# EAGLE board Instruction_memory (EAGLE 9.4.2), part 1 of 2
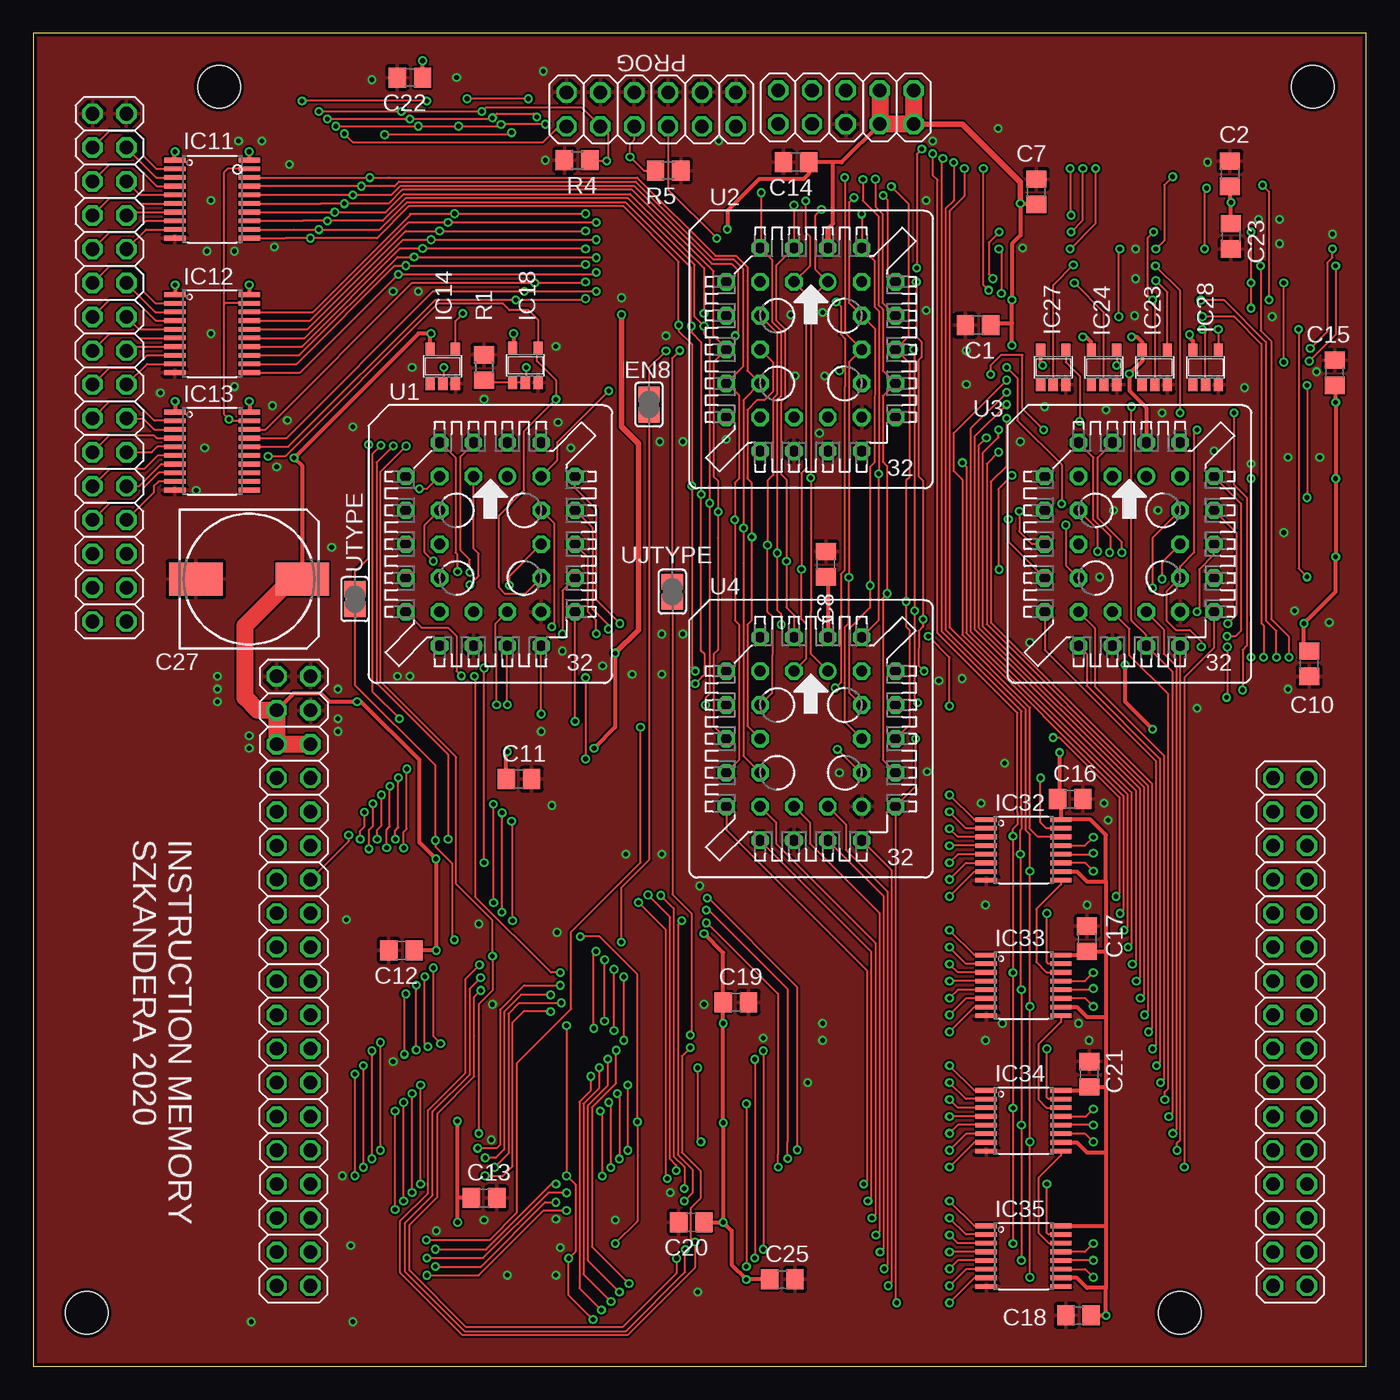
[diagram p2: board, top side]
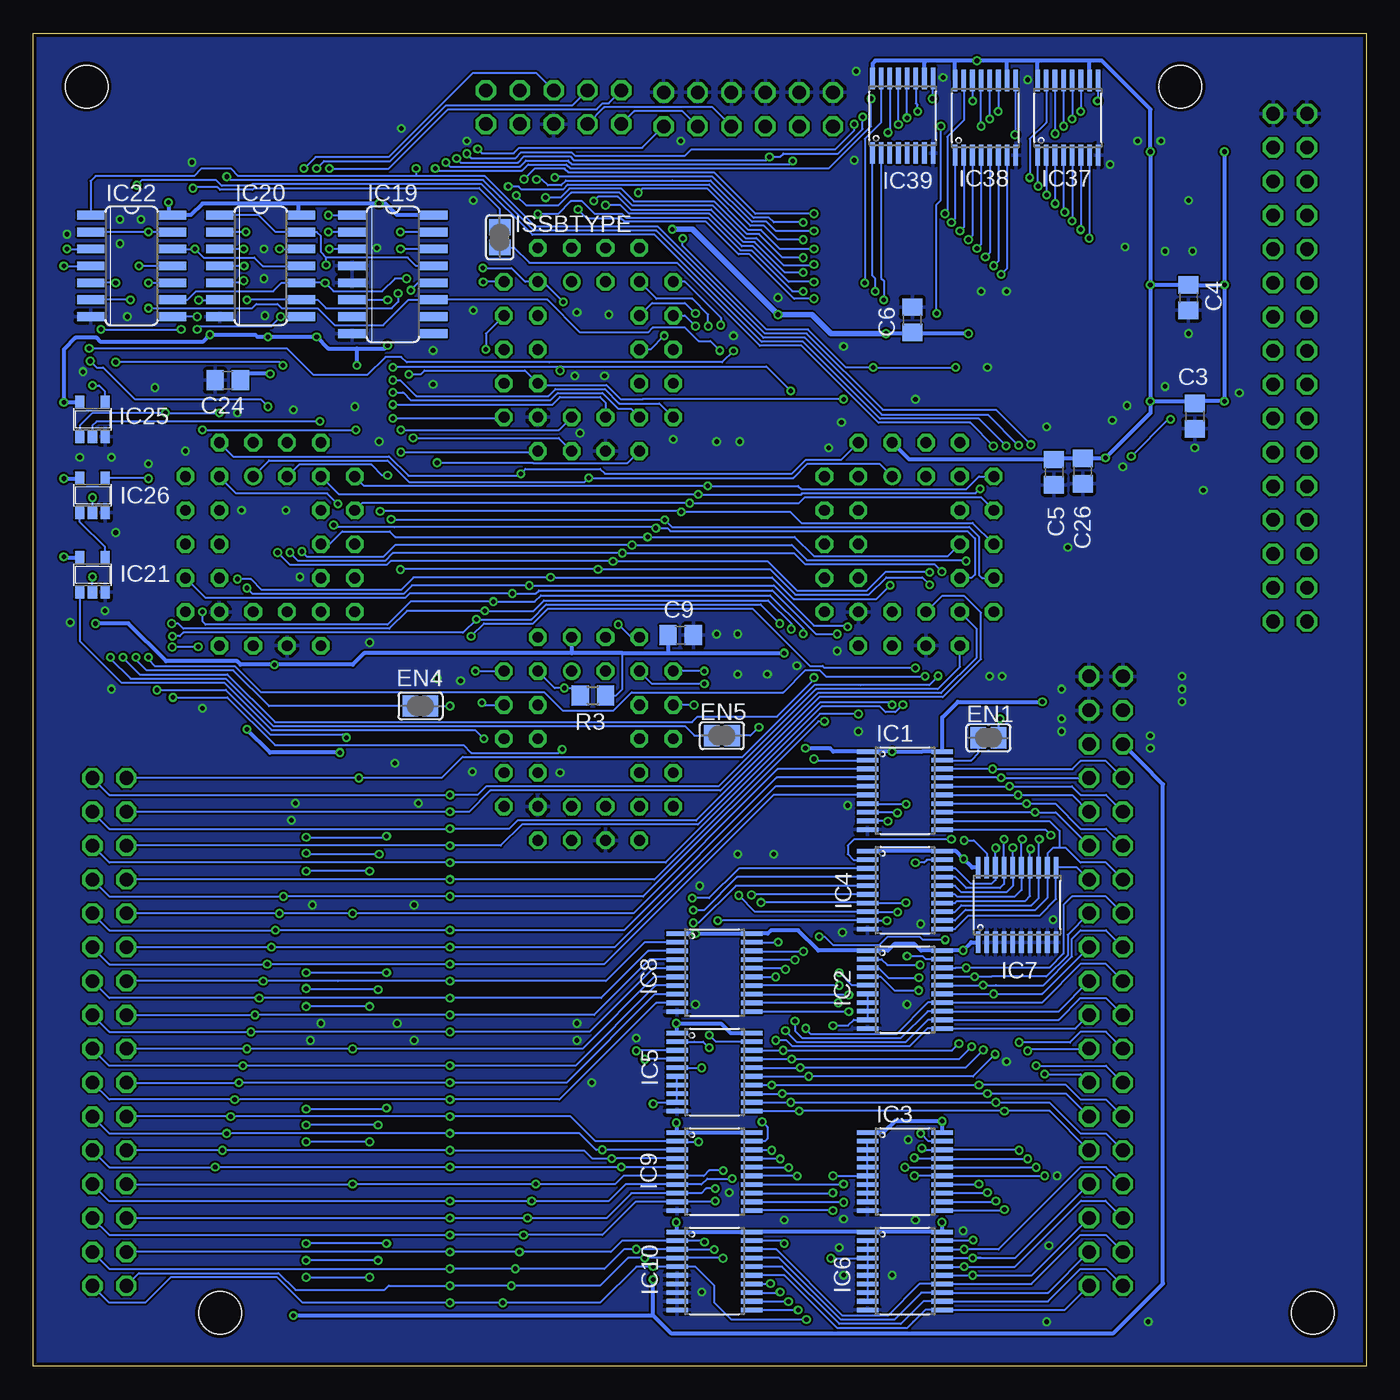
[diagram p3: board, bottom side, seen from below]

Size 100 x 100 mm. Coordinates in mm from the lower left corner, seen from the top.
Outline: 0,0 100,0 100,100 0,100 0,0
Copper layers (1*16): Top 0.035mm / dielectric 1.5mm / Bottom 0.035mm
Design rules "SeeedStudio_2layer_DRU_no_angle_20140221": minimum track width 6mil, minimum drill 12mil, track to track 6mil, track to pad 6mil, pad to pad 6mil, via to via 6mil, smd to smd 0mil, copper to edge 10mil, drill to drill 10mil, minimum pad ring 10mil, minimum via ring 6mil, stop-mask expansion 2mil, vias tented up to drill 100mil, thermal gap 10mil
Holes 3.2 mm at 13.93,96 96,96 4,4 86,4

## Footprints (pad centres in the part's own frame; a part is rotated, then mirrored left to right if it is on the bottom)
C0805 = smd 1.3 x 1.5: 1 -0.95,0; 2 0.95,0
153CLV-1010 = smd 4 x 2.5: + 4,0; - -4,0
SJ = smd 1.168 x 1.6: 1 -0.762,0; 2 0.762,0
TSSOP20 = smd 0.35 x 1.6: 1 -2.925,-2.8; 2 -2.275,-2.8; 3 -1.625,-2.8; 4 -0.975,-2.8; 5 -0.325,-2.8; 6 0.325,-2.8; 7 0.975,-2.8; 8 1.625,-2.8; 9 2.275,-2.8; 10 2.925,-2.8; 11 2.925,2.8; 12 2.275,2.8; 13 1.625,2.8; 14 0.975,2.8; 15 0.325,2.8; 16 -0.325,2.8; 17 -0.975,2.8; 18 -1.625,2.8; 19 -2.275,2.8; 20 -2.925,2.8
SOT23-5 = smd 0.69 x 0.99: 1 -0.95,-1.29; 2 0,-1.29; 3 0.95,-1.29; 4 0.95,1.3; 5 -0.95,1.3
SO16 = smd 0.66 x 2.032: 1 -4.445,-3.073; 2 -3.175,-3.073; 3 -1.905,-3.073; 4 -0.635,-3.073; 5 0.635,-3.073; 6 1.905,-3.073; 7 3.175,-3.073; 8 4.445,-3.073; 9 4.445,3.073; 10 3.175,3.073; 11 1.905,3.073; 12 0.635,3.073; 13 -0.635,3.073; 14 -1.905,3.073; 15 -3.175,3.073; 16 -4.445,3.073
SO14 = smd 0.66 x 2.032: 1 -3.81,-3.073; 2 -2.54,-3.073; 3 -1.27,-3.073; 4 0,-3.073; 5 1.27,-3.073; 6 2.54,-3.073; 7 3.81,-3.073; 8 3.81,3.073; 9 2.54,3.073; 10 1.27,3.073; 11 0,3.073; 12 -1.27,3.073; 13 -2.54,3.073; 14 -3.81,3.073
TSSOP16 = smd 0.35 x 1.6: 1 -2.275,-2.8; 2 -1.625,-2.8; 3 -0.975,-2.8; 4 -0.325,-2.8; 5 0.325,-2.8; 6 0.975,-2.8; 7 1.625,-2.8; 8 2.275,-2.8; 9 2.275,2.8; 10 1.625,2.8; 11 0.975,2.8; 12 0.325,2.8; 13 -0.325,2.8; 14 -0.975,2.8; 15 -1.625,2.8; 16 -2.275,2.8
2X19 = drill 1.016 octagon: 1 -22.86,-1.27; 2 -22.86,1.27; 3 -20.32,-1.27; 4 -20.32,1.27; 5 -17.78,-1.27; 6 -17.78,1.27; 7 -15.24,-1.27; 8 -15.24,1.27; 9 -12.7,-1.27; 10 -12.7,1.27; 11 -10.16,-1.27; 12 -10.16,1.27; 13 -7.62,-1.27; 14 -7.62,1.27; 15 -5.08,-1.27; 16 -5.08,1.27; 17 -2.54,-1.27; 18 -2.54,1.27; 19 0,-1.27; 20 0,1.27; 21 2.54,-1.27; 22 2.54,1.27; 23 5.08,-1.27; 24 5.08,1.27; 25 7.62,-1.27; 26 7.62,1.27; 27 10.16,-1.27; 28 10.16,1.27; 29 12.7,-1.27; 30 12.7,1.27; 31 15.24,-1.27; 32 15.24,1.27; 33 17.78,-1.27; 34 17.78,1.27; 35 20.32,-1.27; 36 20.32,1.27; 37 22.86,-1.27; 38 22.86,1.27
2X16 = drill 1.016 octagon: 1 -19.05,-1.27; 2 -19.05,1.27; 3 -16.51,-1.27; 4 -16.51,1.27; 5 -13.97,-1.27; 6 -13.97,1.27; 7 -11.43,-1.27; 8 -11.43,1.27; 9 -8.89,-1.27; 10 -8.89,1.27; 11 -6.35,-1.27; 12 -6.35,1.27; 13 -3.81,-1.27; 14 -3.81,1.27; 15 -1.27,-1.27; 16 -1.27,1.27; 17 1.27,-1.27; 18 1.27,1.27; 19 3.81,-1.27; 20 3.81,1.27; 21 6.35,-1.27; 22 6.35,1.27; 23 8.89,-1.27; 24 8.89,1.27; 25 11.43,-1.27; 26 11.43,1.27; 27 13.97,-1.27; 28 13.97,1.27; 29 16.51,-1.27; 30 16.51,1.27; 31 19.05,-1.27; 32 19.05,1.27
2X06 = drill 1.016 octagon: 1 -6.35,-1.27; 2 -6.35,1.27; 3 -3.81,-1.27; 4 -3.81,1.27; 5 -1.27,-1.27; 6 -1.27,1.27; 7 1.27,-1.27; 8 1.27,1.27; 9 3.81,-1.27; 10 3.81,1.27; 11 6.35,-1.27; 12 6.35,1.27
2X05 = drill 1.016 octagon: 1 -5.08,-1.27; 2 -5.08,1.27; 3 -2.54,-1.27; 4 -2.54,1.27; 5 0,-1.27; 6 0,1.27; 7 2.54,-1.27; 8 2.54,1.27; 9 5.08,-1.27; 10 5.08,1.27
R0805 = smd 1.3 x 1.5: 1 -0.95,0; 2 0.95,0
S32 = drill 0.813: 1 1.27,5.08 | drill 0.813 octagon: 2 -1.27,7.62; 3 -1.27,5.08; 4 -3.81,7.62; 5 -6.35,5.08; 6 -3.81,5.08; 7 -6.35,2.54; 8 -3.81,2.54; 9 -6.35,0; 10 -3.81,0; 11 -6.35,-2.54; 12 -3.81,-2.54; 13 -6.35,-5.08; 14 -3.81,-7.62; 15 -3.81,-5.08; 16 -1.27,-7.62; 17 -1.27,-5.08; 18 1.27,-7.62; 19 1.27,-5.08; 20 3.81,-7.62; 21 6.35,-5.08; 22 3.81,-5.08; 23 6.35,-2.54; 24 3.81,-2.54; 25 6.35,0; 26 3.81,0; 27 6.35,2.54; 28 3.81,2.54; 29 6.35,5.08; 30 3.81,7.62; 31 3.81,5.08; 32 1.27,7.62

## Placement (x,y rotation side)
C1  [C0805]  70.88,78.11 180 top
C2  [C0805]  89.77,89.46 90 top
C3  [C0805]  12.86,71.28 270 bottom
C4  [C0805]  13.34,80.17 270 bottom
C5  [C0805]  23.42,67.07 270 bottom
C6  [C0805]  34.05,78.5 90 bottom
C7  [C0805]  75.25,88.11 90 top
C8  [C0805]  59.45,60.17 90 top
C9  [C0805]  51.44,54.85 0 bottom
C10  [C0805]  95.73,52.7 270 top
C11  [C0805]  36.43,44.05 0 top
C12  [C0805]  27.62,31.19 180 top
C13  [C0805]  33.81,12.62 0 top
C14  [C0805]  57.23,90.33 180 top
C15  [C0805]  97.63,74.53 90 top
C16  [C0805]  77.79,42.55 0 top
C17  [C0805]  79.06,32.07 90 top
C18  [C0805]  78.42,3.81 180 top
C19  [C0805]  52.7,27.3 0 top
C20  [C0805]  49.37,10.79 180 top
C21  [C0805]  79.22,21.91 90 top
C22  [C0805]  28.26,96.68 180 top
C23  1u  [C0805]  89.85,84.77 270 top
C24  1u  [C0805]  85.41,73.98 180 bottom
C25  1u  [C0805]  56.2,6.51 0 top
C26  1u  [C0805]  21.27,67.15 270 bottom
C27  [153CLV-1010]  16.19,59.05 0 top
EN1  [SJ]  28.34,47.15 0 bottom
EN4  [SJ]  70.96,49.53 180 bottom
EN5  [SJ]  48.34,47.31 0 bottom
EN8  [SJ]  46.2,72.15 90 top
IC1  74245  [TSSOP20]  34.61,43.18 270 bottom
IC2  74245  [TSSOP20]  34.61,28.26 270 bottom
IC3  74245  [TSSOP20]  34.61,14.61 270 bottom
IC4  74245  [TSSOP20]  34.61,35.72 270 bottom
IC5  74245  [TSSOP20]  48.9,22.07 270 bottom
IC6  74245  [TSSOP20]  34.61,7.14 270 bottom
IC7  74245  [TSSOP20]  26.19,34.61 0 bottom
IC8  74245  [TSSOP20]  48.9,29.53 270 bottom
IC9  74245  [TSSOP20]  48.9,14.61 270 bottom
IC10  74245  [TSSOP20]  48.9,7.14 270 bottom
IC11  74245  [TSSOP20]  13.41,87.55 270 top
IC12  74245  [TSSOP20]  13.41,77.47 270 top
IC13  74245  [TSSOP20]  13.41,68.66 270 top
IC14  74AHC1G04DBV  [SOT23-5]  30.72,75.01 0 top
IC18  74AHC1G08DBV  [SOT23-5]  36.91,75.09 0 top
IC19  74AC138D  [SO16]  73.03,81.92 270 bottom
IC20  74AC08D  [SO14]  82.95,82.55 270 bottom
IC21  74AHC1G08DBV  [SOT23-5]  95.57,59.37 0 bottom
IC22  74AC08D  [SO14]  92.63,82.55 270 bottom
IC23  74AHC1G04DBV  [SOT23-5]  84.14,74.93 0 top
IC24  74AHC1G04DBV  [SOT23-5]  80.33,74.93 0 top
IC25  74AHC1G08DBV  [SOT23-5]  95.57,71.04 0 bottom
IC26  74AHC1G32DBV  [SOT23-5]  95.57,65.33 0 bottom
IC27  74AHC1G04DBV  [SOT23-5]  76.52,74.93 0 top
IC28  74AHC1G04DBV  [SOT23-5]  87.95,74.93 0 top
IC32  74595  [TSSOP16]  74.3,38.73 270 top
IC33  74595  [TSSOP16]  74.3,28.57 270 top
IC34  74595  [TSSOP16]  74.3,18.41 270 top
IC35  74595  [TSSOP16]  74.3,8.26 270 top
IC37  74595  [TSSOP16]  22.38,93.66 0 bottom
IC38  74595  [TSSOP16]  28.57,93.66 0 bottom
IC39  74595  [TSSOP16]  34.77,93.82 0 bottom
IMM_C0  [2X19]  19.53,28.89 270 top
INS_C0  [2X16]  94.3,25.08 270 top
ISSBTYPE  [SJ]  65.01,84.69 270 bottom
PC_ADR_C0  [2X16]  5.71,74.92 270 top
PROG  [2X06]  46.35,94.3 0 top
PROG_THR_C0  PINHD-2X5  [2X05]  60.96,94.46 0 top
R1  10k  [R0805]  33.81,74.93 270 top
R3  10k  [R0805]  58.02,50.32 0 bottom
R4  10k  [R0805]  40.8,90.49 0 top
R5  10k  [R0805]  47.62,89.69 180 top
U1  [S32]  34.29,61.67 0 top
U2  [S32]  58.34,76.28 0 top
U3  [S32]  82.23,61.67 0 top
U4  [S32]  58.34,47.07 0 top
UJTYPE  [SJ]  47.94,58.1 90 top
UTYPE  [SJ]  24.13,57.55 90 top

## Tracks (layer width: path | path; a pad name or v marks a point on that pad's centre or on a via)
#I_S_TYPE  (via drill 0.35)
  Top 0.152: v94.93,77.79 94.93,59.85 v95.57,59.21 | v88.9,77.79 IC28.4
  Bottom 0.152: IC21.2 v95.57,59.21 | v94.93,77.79 v88.9,77.79
#I_TYPE  (via drill 0.35)
  Top 0.152: IC24.4 v81.28,75.09 | v93.82,75.33 v93.82,81.28
  Bottom 0.152: v81.28,75.09 81.52,75.33 v93.82,75.33 | v93.82,81.28 IC22.5
#S_TYPE  (via drill 0.35)
  Top 0.152: IC23.4 85.09,80.57 v84.22,81.44
  Bottom 0.152: v84.22,81.44 84.38,81.28 IC20.5
#SB_TYPE  (via drill 0.35)
  Top 0.152: IC27.4 77.47,75.33 78.5,74.3 v78.5,70.88
  Bottom 0.152: v78.5,70.88 95.25,70.88 95.57,70.56 IC25.2
#WE  (via drill 0.35)
  Top 0.152: v60.25,79.85 60.58,79.52 60.58,77.42 60.89,77.11 60.89,75.41 60.89,75.01 | v60.17,50.88 60.59,51.3 60.59,59.43 60.89,59.73 60.89,73.5 60.89,74.85 60.89,75.01 | 60.89,75.01 60.89,74.69 v60.48,74.69 | v43.18,73.18 39.29,69.29 39.29,67.94 U1.31 | v73.03,74.93 73.82,74.14 73.82,70.96 77.15,67.63 v77.15,64.69 | v66.66,91.32 66.28,90.94 v66.28,82.39
  Bottom 0.152: v60.25,79.85 61.75,81.36 U2.31 63.1,81.36 64.14,82.39 v66.28,82.39 | U4.31 60.88,50.88 v60.17,50.88 59.53,50.88 R3.1 | v77.15,64.69 77.95,65.48 84.77,65.48 U3.31 | v43.18,73.18 45.01,75.01 60.4,75.01 60.48,75.01 | 60.48,75.01 72.95,75.01 v73.03,74.93 | 60.48,75.01 v60.48,74.69 | v66.66,91.32 66.34,91.01 63.96,91.01 63.56,91.41 54.33,91.41 PROG.11
ADR_0  (via drill 0.35)
  Top 0.152: U4.12 53.26,45.8 53.26,60.25 53.26,62.79 | 53.26,62.79 53.26,72.47 U2.12 53.58,74.69 53.58,82.47 52.73,83.32 51.17,83.32 45.31,89.18 26.67,89.18 v25.24,89.18 IC11.18 | 53.26,62.79 53.26,62.85 v53.29,62.88 | v77.47,63.1 77.47,60.09 U3.12
  Bottom 0.152: v77.47,63.1 77.31,62.94 72.9,62.94 53.35,62.94 v53.29,62.88 52.44,62.88 52.21,62.65 29.91,62.65 29.36,62.1 29.36,59.38 29.61,59.13 U1.12 | IC37.15 24.01,93.31 25.24,92.08 v25.24,89.18
ADR_1  (via drill 0.35)
  Top 0.152: U4.11 52.96,45.5 52.94,55.65 52.63,55.96 52.63,59.53 v52.63,63.5 52.63,66.28 52.96,66.61 52.96,72.85 52.07,73.74 U2.11 53.27,75.02 53.27,82.3 52.56,83.01 51.04,83.01 45.18,88.87 27.43,88.87 27.09,88.53 25.99,88.53 v24.61,88.53 IC11.17 | v73.15,63.55 73.15,61.87 U3.11
  Bottom 0.152: v73.15,63.55 73.1,63.5 v52.63,63.5 52.08,62.96 29.78,62.96 29.05,62.23 29.05,59.37 28.81,59.13 U1.11 | IC37.1 24.66,88.58 v24.61,88.53
ADR_2  (via drill 0.35)
  Top 0.152: v52.67,77.31 52.88,77.52 52.88,82.22 52.39,82.71 50.91,82.71 45.06,88.57 27.56,88.57 26.87,87.88 25.4,87.88 v23.97,87.88 IC11.16 | U2.10 55.48,75.33 55.48,74.22 55.48,73.1 54.85,72.47 54.29,72.47 53.57,71.75 53.57,66.61 53.9,66.28 53.9,62.39 | U4.10 53.57,48.03 53.58,55.64 53.9,55.96 53.9,61.04 53.9,62.39 | 53.9,62.39 53.91,62.37 v53.91,62.22
  Bottom 0.152: v52.67,77.31 53.7,76.28 U2.10 | U3.10 77.79,61.67 76.83,62.64 73.26,62.64 72.84,62.22 v53.91,62.22 42.88,62.22 41.45,60.78 31.37,60.78 U1.10 | IC37.2 24.01,87.91 v23.97,87.88
ADR_3  (via drill 0.35)
  Top 0.152: U4.9 51.04,48.02 51.04,53.42 51.36,53.74 51.36,62.15 51.36,64.06 51.36,64.14 | 51.36,64.14 51.36,66.44 51.04,66.75 51.04,75.33 U2.9 51.99,76.36 51.04,77.31 51.04,82.15 44.93,88.26 27.69,88.26 26.65,87.23 v23.34,87.23 21.59,87.23 IC11.15 | 51.36,64.14 v51.38,64.11 | U3.9 74.93,61.67 73.98,62.63 v73.98,64.14
  Bottom 0.152: v73.98,64.14 73.98,64.16 73.95,64.19 51.46,64.19 v51.38,64.11 43.23,64.11 42.39,63.26 29.53,63.26 U1.9 | IC37.3 23.36,87.25 v23.34,87.23
ADR_4  (via drill 0.35)
  Top 0.152: U2.8 55.79,77.56 55.79,72.9 55.5,72.61 55.5,66.85 55.09,66.44 v55.09,61.61 55.09,56.59 55.44,56.24 55.42,50.5 U4.8 | v79.85,61.12 79.85,62.79 U3.8 | v30,60.4 29.37,61.04 29.37,63.1 U1.8 | IC11.14 20.87,86.58 v22.61,86.58 26.43,86.58 27.79,87.94 44.78,87.94 50.32,82.39 v50.32,78.98
  Bottom 0.152: v50.32,78.98 51.12,79.77 53.58,79.77 U2.8 | v79.85,61.12 79.45,60.72 73.74,60.72 72.85,61.61 v55.09,61.61 43.1,61.61 41.97,60.48 30.08,60.48 v30,60.4 | IC37.4 22.71,86.67 v22.61,86.58
ADR_5  (via drill 0.35)
  Top 0.152: v50.43,49.61 50.43,50.12 50.73,50.42 50.73,64.77 | 50.73,64.77 50.73,66.05 50.73,77.06 50.32,77.47 v50.32,78.03 49.61,78.74 49.61,82.63 45.88,86.36 44.61,87.63 27.92,87.63 26.21,85.93 v22.07,85.93 20.22,85.93 IC11.13 | 50.73,64.77 v50.75,64.75
  Bottom 0.152: U2.7 51.12,78.82 v50.32,78.03 | v50.43,49.61 U4.7 | U3.7 75.34,64.75 v50.75,64.75 42.56,64.75 42.12,65.19 28.92,65.19 U1.7 | IC37.5 v22.06,85.93 v22.07,85.93
ADR_6  (via drill 0.35)
  Top 0.152: v49.65,51.2 50.17,51.71 50.37,51.91 50.37,53.42 50.11,53.67 v50.11,65.41 50.11,76.83 49.37,77.56 v49.37,78.03 49.29,78.11 49.29,82.47 44.44,87.33 28.05,87.33 26,85.28 v21.43,85.28 19.57,85.28 IC11.12 | v28.97,65.83 29.56,65.83 U1.6
  Bottom 0.152: v49.37,78.03 49.37,78.9 50.56,80.09 53.26,80.09 U2.6 | v49.65,51.2 53.58,51.2 U4.6 | U3.6 77.07,65.41 v50.11,65.41 42.39,65.41 42.29,65.5 29.3,65.5 v28.97,65.83 | IC37.6 21.41,85.3 v21.43,85.28
ADR_7  (via drill 0.35)
  Top 0.152: v49.66,52.15 49.41,52.4 v49.41,66.04 49.41,76.68 48.42,77.67 v48.42,78.11 48.42,82.87 44.27,87.02 28.17,87.02 25.78,84.63 v20.8,84.63 18.89,84.63 IC11.11
  Bottom 0.152: U2.5 51.12,81.36 48.42,78.66 v48.42,78.11 | v49.66,52.15 U4.5 | U3.5 75.17,66.04 v49.41,66.04 42.62,66.04 42.39,65.8 30,65.8 29.05,66.75 U1.5 | IC37.7 20.76,84.66 v20.8,84.63
ADR_8  (via drill 0.35)
  Top 0.152: v63.18,89.06 63.18,87 63.72,86.45 63.72,79.79 U2.27 | v66.04,76.28 66.12,76.2 66.12,64.06 v66.12,56.67 66.12,50.01 v66.36,49.77 | v89.61,55.72 90.25,56.36 90.25,62.55 U3.27 | v43.14,55.31 43.14,55.63 41.95,56.82 41.95,62.91 U1.27 | IC12.18 20.99,79.09 28.26,86.36 28.26,86.47 31.59,86.47 v31.61,86.47 v41.43,86.47
  Bottom 0.152: v63.18,89.06 62.39,89.85 60.14,89.85 59.85,89.56 48.92,89.56 45.83,86.47 v41.43,86.47 | U2.27 66.04,77.47 v66.04,76.28 | v66.36,49.77 66.2,49.61 U4.27 | v89.61,55.72 89.14,55.72 88.75,55.34 73.3,55.34 71.96,56.67 v66.12,56.67 62.47,56.67 61.69,57.45 44.88,57.45 43.14,55.71 v43.14,55.31 | IC38.15 30.2,93.47 31.43,92.23 31.43,86.64 v31.61,86.47
ADR_9  (via drill 0.35)
  Top 0.152: v60.88,89.19 60.88,77.55 U2.26 61.2,75.33 v61.2,59.18 61.2,55.76 60.89,55.45 60.89,48.33 U4.26 | v84.69,59.05 84.69,60.33 U3.26 | v35.72,58.58 35.72,59.29 U1.26 | IC12.17 20.79,78.44 28.16,85.81 v31.11,85.81 v42.23,85.81 v42.23,85.82
  Bottom 0.152: v60.88,89.19 60.82,89.26 49.05,89.26 45.95,86.16 44.79,86.16 44.45,85.82 v42.23,85.82 | v84.69,59.05 83.66,59.05 82.85,58.24 72.41,58.24 71.47,59.18 v61.2,59.18 44.56,59.18 42.96,57.57 36.73,57.57 v35.72,58.58 | IC38.1 30.85,86.08 v31.11,85.81
ADR_10  (via drill 0.35)
  Top 0.152: v62.24,89.04 62.24,87.45 63.42,86.27 63.42,79.62 63.74,79.3 63.74,74.69 U2.23 63.74,72.79 63.74,67.87 64.06,67.55 v64.06,57.97 64.06,57.94 63.74,57.63 63.74,45.48 U4.23 | U1.23 39.69,58.18 v39.69,54.93 | IC12.16 20.58,77.8 27.95,85.17 v30.48,85.17 v41.43,85.17
  Bottom 0.152: v62.24,89.04 61.84,89.04 61.39,88.59 60.4,88.59 60.03,88.95 52.08,88.95 49.18,88.95 46.08,85.86 44.98,85.86 44.29,85.17 v41.43,85.17 | U3.23 87.08,57.64 72.1,57.64 71.77,57.97 v64.06,57.97 62.31,57.97 62.07,58.2 44.55,58.2 41.27,54.93 v39.69,54.93 | IC38.2 30.2,85.44 v30.48,85.17
ADR_11  (via drill 0.35)
  Top 0.152: v64.37,88.5 65.64,87.23 65.64,77.23 U2.25 65.72,75.25 65.72,66.67 65.48,66.44 v65.48,57.36 65.48,55.48 65.72,55.24 65.72,48.1 U4.25 | v87.31,56.59 87.47,56.75 87.47,59.77 88.58,60.88 U3.25 | v42.23,54.94 42.23,55.97 41.59,56.61 41.59,60.72 U1.25 | IC12.15 20.37,77.14 27.74,84.52 v29.84,84.52 v42.22,84.52 v42.23,84.52
  Bottom 0.152: v64.37,88.5 63.58,88.5 63.36,88.28 60.27,88.28 59.91,88.65 49.3,88.65 46.2,85.55 45.16,85.55 44.13,84.52 v42.23,84.52 | v87.31,56.59 87.31,55.88 87.07,55.64 73.42,55.64 71.7,57.36 v65.48,57.36 62.39,57.36 61.91,57.84 44.73,57.84 42.23,55.34 v42.23,54.94 | IC38.3 29.55,84.81 v29.84,84.52
ADR_12  (via drill 0.35)
  Top 0.152: v54.61,88.04 54.61,83.98 U2.4 55.42,83.01 55.42,78.36 56.09,77.69 56.09,72.76 55.8,72.47 v55.8,61 55.8,56.74 56.11,56.44 v56.11,55.64 | v80.76,61.04 80.79,61.07 80.79,62.28 79.53,63.53 79.53,68.18 U3.4 | v31.83,59.61 31.83,60.88 31.67,61.04 31.67,68.18 30.56,69.29 U1.4 | IC12.14 20.16,76.5 27.54,83.86 v29.21,83.86 41.39,83.86 v41.43,83.82
  Bottom 0.152: v54.61,88.04 54.31,88.34 49.43,88.34 46.33,85.25 45.4,85.25 43.97,83.82 v41.43,83.82 | U4.4 55.15,54.69 v56.11,55.64 | v80.76,61.04 80.14,60.42 73.61,60.42 73.03,61 v55.8,61 42.92,61 42.1,60.18 32.4,60.18 v31.83,59.61 | IC38.4 28.9,84.17 v29.21,83.86
ADR_13  (via drill 0.35)
  Top 0.152: v61.57,87.68 61.19,87.3 61.19,79.78 U2.28 63.13,77.84 63.1,67.79 62.79,67.47 v62.79,58.57 62.79,56.91 61.2,55.32 61.2,50.56 U4.28 | v83.98,58.38 83.98,62.15 U3.28 | v38.89,55.48 39.05,55.64 39.05,63.26 U1.28 | IC12.13 19.96,75.84 27.33,83.22 v28.57,83.22 42.18,83.22 v42.23,83.17
  Bottom 0.152: v61.57,87.68 60.44,87.68 59.77,88.34 55.88,88.34 54.94,87.4 48.92,87.4 46.46,84.94 45.55,84.94 43.78,83.17 v42.23,83.17 | v83.98,58.38 83.53,57.94 77.31,57.94 72.23,57.94 71.6,58.57 v62.79,58.57 44.45,58.57 41.43,55.56 38.97,55.56 v38.89,55.48 | IC38.5 28.25,83.54 v28.57,83.22
ADR_14  (via drill 0.35)
  Top 0.152: U2.29 64.09,81.96 64.09,87.52 v63.77,87.84 | v66.25,81.36 66.25,77.26 66.65,76.86 66.65,75.7 66.42,75.47 66.42,66.77 66.75,66.44 v66.75,56.04 | v66.83,52.15 66.42,52.56 66.44,55.17 66.75,55.48 v66.75,56.04 | v66.75,56.04 v66.76,56.03 | v89.57,54.77 90.21,54.77 90.6,55.17 90.6,64.73 U3.29 | v44.01,55.72 42.25,57.48 42.25,64.26 40.64,65.87 U1.29 | IC12.12 19.75,75.19 27.12,82.56 v27.94,82.56 41.34,82.56 v41.43,82.66
  Bottom 0.152: v63.77,87.84 63,87.07 60.61,87.07 59.64,88.04 56.01,88.04 55.04,87.07 49.02,87.07 46.58,84.64 45.75,84.64 43.73,82.62 41.48,82.62 v41.43,82.66 | U2.29 v66.25,81.36 | v66.83,52.15 U4.29 | v89.57,54.77 89.02,54.77 88.75,55.03 67.76,55.03 v66.76,56.03 62.63,56.03 61.52,57.15 45.44,57.15 v44.01,55.72 | IC38.6 27.6,82.91 v27.94,82.56
ADR_15  (via drill 0.35)
  Top 0.152: v57.94,87.43 57.94,85.09 58.26,84.77 58.26,82.55 U2.3 58.02,80.41 58.02,67.39 57.63,66.99 v57.63,59.79 57.63,56.04 57.96,55.7 57.96,53.04 U4.3 | v72.47,59.77 72.39,59.85 72.39,65.8 v73.42,66.83 | v32.75,58.63 33.42,59.29 33.42,60.96 33.02,61.36 U1.3 | IC12.11 20.02,74.55 v27.39,81.92 42.08,81.92 v42.23,82.06
  Bottom 0.152: v57.94,87.43 57.64,87.73 56.13,87.73 55.17,86.77 49.15,86.77 46.71,84.33 45.88,84.33 43.6,82.06 v42.23,82.06 | v72.47,59.77 72.45,59.79 v57.63,59.79 44.74,59.79 42.83,57.88 37.31,57.88 36,59.18 33.3,59.18 v32.75,58.63 | v73.42,66.83 73.82,66.83 74.63,67.64 80.07,67.64 U3.3 | IC38.7 26.95,82.36 v27.39,81.92
ADR_16  (via drill 0.35)
  Top 0.152: v57.07,87.1 U2.2 55.72,82.55 55.72,78.49 56.4,77.81 56.4,72.64 56.11,72.35 56.11,66.92 56.52,66.52 56.51,60.4 | U4.2 57.07,56.36 56.51,56.92 56.51,60.4 | 56.51,60.4 v56.51,60.39 | v81.67,61.04 81.67,61.83 79.85,63.65 79.85,68.18 U3.2 | v32.75,59.56 32.75,60.52 32.05,61.21 32.05,68.25 33.02,69.22 U1.2 | IC13.18 17.42,70.28 28.42,81.28 v37.62,81.28 41.35,81.28 v41.43,81.36
  Bottom 0.152: v57.07,87.1 55.93,87.1 55.29,86.47 49.27,86.47 46.84,84.03 46,84.03 43.33,81.36 v41.43,81.36 | v81.67,61.04 80.74,60.11 73.49,60.11 73.2,60.39 v56.51,60.39 44.92,60.39 42.7,58.18 37.47,58.18 36.08,59.56 v32.75,59.56 | IC39.15 36.39,93.31 37.62,92.08 v37.62,81.28
ADR_17  (via drill 0.35)
  Top 0.152: v62.15,86.44 U2.30 62.98,83.07 | 63.11,82.94 63.06,82.99 | 63.06,82.99 62.98,83.07 | 62.98,83.07 63.06,82.99 | 63.06,82.99 63.11,82.94 | 63.11,82.94 63.11,79.49 63.43,79.17 63.43,66.99 | 63.43,66.99 63.43,55.97 U4.30 | v63.43,66.95 | v63.43,66.95 63.43,66.99 | IC13.17 18.99,69.63 30,80.64 v36.83,80.64 v42.23,80.64
  Bottom 0.152: v62.15,86.44 60.64,86.44 59.69,87.39 58.82,87.39 57.86,86.44 55.8,86.44 55.52,86.16 49.4,86.16 46.96,83.72 46.13,83.72 43.05,80.64 v42.23,80.64 | U3.30 85.01,68.26 73.31,68.26 71.86,66.81 63.57,66.81 v63.43,66.95 63.08,67.31 57.47,67.31 57.11,66.95 43.1,66.95 42.04,68.01 39.38,68.01 U1.30 | v36.83,80.64 36.83,81.6 37.04,81.81 IC39.1
ADR_18  (via drill 0.35)
  Top 0.152: v59.13,86.78 58.66,86.31 58.66,82.31 U2.1 58.33,80.08 v58.33,66.65 58.33,62.83 58.33,56.59 58.33,53.43 U4.1 | IC13.16 19.14,68.98 30.16,80.01 v36.2,80.01 41.35,80.01 v41.43,80.09
  Bottom 0.152: v59.13,86.78 58.48,86.14 55.93,86.14 55.65,85.86 49.53,85.86 47.09,83.42 46.25,83.42 42.92,80.09 v41.43,80.09 | U3.1 82.31,67.95 73.42,67.95 71.82,66.34 58.63,66.34 v58.33,66.65 42.97,66.65 41.91,67.71 36.51,67.71 U1.1 | IC39.2 36.39,81.64 36.2,81.44 v36.2,80.01
EN_1  (via drill 0.35)
  Top 0.152: v26.08,69.08 25.45,68.46 25.45,50.59 v27.46,48.58 | v84.22,83.82 84.85,84.45 84.85,88.61 v85.49,89.25
  Bottom 0.152: v26.08,69.08 28.38,71.39 36.34,71.39 42.12,77.17 45.24,77.17 53.25,85.18 62.44,85.18 64.99,87.73 66.25,88.99 85.23,88.99 v85.49,89.25 | v84.22,83.82 IC20.3 | IC1.19 29.63,45.45 29.1,45.99 EN1.1 EN1.2 27.57,48.47 v27.46,48.58
EN_4  (via drill 0.35)
  Top 0.152: v92.31,53.18 92.31,55.56 92.15,55.72 92.15,76.68 90.09,78.74 v87.71,78.74 | v68.74,49.53 68.74,53.18 v67.15,54.77 | v33.81,37.78 v33.81,52.39
  Bottom 0.152: IC4.19 32.97,37.99 33.18,37.78 v33.81,37.78 | v92.31,53.18 92.31,53 91.5,52.2 85,52.2 82.32,49.53 EN4.2 EN4.1 v68.74,49.53 | v87.71,78.74 IC22.8 | v67.15,54.77 66.19,55.73 62.51,55.73 61.39,56.84 46.05,56.84 41.74,52.53 40.79,52.53 40.64,52.39 v33.81,52.39
EN_6  (via drill 0.35)
  Top 0.152: v92.08,82.55 92.08,77.71 92.87,76.91 92.87,71.12 92.87,56.04 94.22,54.69 v94.22,53.18 | v29.48,9.46 34.22,9.46 36.27,11.51 36.27,22.7 40.36,26.79 40.36,32.58 45.56,37.78 v45.56,47.94
  Bottom 0.152: IC22.11 v92.08,82.55 | v94.22,53.18 94.22,53.1 92.71,51.59 85.57,51.59 81.99,48.02 51.12,48.02 50.4,47.31 EN5.1 EN5.2 46.2,47.31 v45.56,47.94 | IC6.19 31.77,9.46 v29.48,9.46
EN_8  (via drill 0.35)
  Top 0.152: v95.81,76.36 97.08,77.63 97.08,82.79 97.47,83.19 v97.47,83.82 | v47.47,76.17 46.2,74.9 EN8.2 EN8.1 46.2,37.99 44.11,35.9 v44.11,31.8
  Bottom 0.152: v44.11,31.8 IC8.19 | v47.47,76.17 48.32,75.31 61.29,75.31 71.99,75.33 72.39,75.72 73.58,75.72 74.94,74.36 78.97,74.36 80.96,76.36 v95.81,76.36 | v97.47,83.82 IC22.3
GND  (via drill 0.35)
  other vias: 75.88,71.99 74.06,69.37 84.69,71.52 90.88,73.42 88.58,68.66 91.36,67.71 96.52,68.18 94.14,68.18 84.38,64.21 81.04,64.21 80.01,59.21 80.49,71.75 74.22,83.9 67.94,51.44 82.63,78.82 92.95,78.74 97.23,55.8 96.28,74.61 93.5,86.04 91.92,86.04 60.48,44.53 67.07,44.61 33.42,33.18 30.24,10.16 39.29,32.54 34.45,27.15 34.37,16.99 39.21,11.03 39.53,8.89 39.69,53.66 58.98,70.01 51.99,69.53 97.47,84.93 93.5,84.22 82.71,83.82 82.71,81.6 67.47,91.92 66.99,87.47 51.44,91.92 38.42,90.49 59.21,79.06 56.83,78.9 57.15,74.3 59.37,74.3 66.99,79.22 70.01,76.2 70.01,73.66 74.77,54.29 87.31,49.37 94.61,56.67 94.14,50.8 93.82,62.55 72.87,45.24 69.69,51.59 79.06,34.61 71.44,34.61 80.64,40.96 80.33,42.23 71.12,42.23 71.44,24.45 72.71,25.72 78.42,25.72 79.22,24.45 58.1,21.27 59.21,25.72 59.21,24.45 54.77,24.61 50.32,27.15 50.01,36.04 47.15,38.42 44.45,38.42 38.89,42.07 38.1,47.62 44.93,51.91 47.15,51.91 47.15,54.93 48.74,54.93 42.7,52.55 23.5,33.5 26.99,22.86 33.81,10.95 43.66,10.95 47.78,13.02 49.85,5.56 35.56,6.83 39.21,6.83 23.97,3.33 23.81,9.05 23.18,14.29 40.32,68.9 39.37,70.8 46.99,69.37 48.74,69.37 47.47,77.31 44.13,80.17 39.21,76.52 33.81,72.55 28.42,74.93 26.99,80.64 12.86,68.9 12.22,65.72 9.53,73.03 13.34,77.47 15.08,73.5 15.08,83.66 13.02,83.66 13.34,87.47 15.4,91.92 17.14,91.92 18.1,83.98 19.21,90.17 25.4,96.52 31.75,96.68 38.26,97.16 16.35,3.33 13.81,51.75 13.81,50.8 13.81,49.85 16.19,46.35 16.19,47.31 22.86,48.58 22.86,47.62 27.3,51.75 28.26,51.75 22.38,61.44 23.97,70.48 19.05,70.96 88.11,90.33 72.39,92.87 18.26,67.47 17.94,72.07 28.89,80.64 22.86,50.8
  pour Bottom: -6.99,106.2 105.25,106.2 105.25,77.95 105.25,-6.83 69.85,-6.83 -6.99,-6.83
  pour Top: -7.62,106.84 107.47,106.84 107.47,7.3 107.47,-8.57 6.35,-8.57 -7.62,-8.57
I_S_SB_TYPE  (via drill 0.35)
  Top 0.152: v33.42,17.46 33.42,27.15 34.45,28.18 v34.45,30.75 34.45,33.45 31.74,36.16 31.74,45.69 26.06,51.36 26.06,67.13 v27.96,69.03 | v88.03,88.39 87.87,88.23 v87.87,83.82
  Bottom 0.152: IC22.12 v87.87,83.82 87.23,83.19 83.42,83.19 82.79,82.55 IC20.11 | IC3.19 32.83,16.88 v33.42,17.46 | v27.96,69.03 29.71,70.78 36.59,70.78 42.37,76.56 45.49,76.56 51.72,82.79 62.79,82.79 63.93,83.93 ISSBTYPE.2 ISSBTYPE.1 65.01,86.84 66.55,88.38 83.43,88.38 83.56,88.25 85.99,88.25 86.18,88.45 87.97,88.45 v88.03,88.39 | IC2.19 33.04,30.53 33.26,30.75 v34.45,30.75
I_S_TYPE  (via drill 0.35)
  Top 0.152: v81.44,78.74 81.44,83.74 v81.52,83.82 | IC28.2 87.95,77.53 87.71,77.77 v87.71,77.79
  Bottom 0.152: IC20.8 v81.44,78.74 82.15,78.03 87.47,78.03 v87.71,77.79 | v81.52,83.82 IC20.12
I_TYPE  (via drill 0.35)
  Top 0.152: v71.99,81.6 71.68,81.92 71.68,84.3 v72.47,85.09 | IC24.2 80.33,79.06 v78.11,81.28
  Bottom 0.152: IC19.15 v72.47,85.09 | v71.99,81.6 72.87,81.6 73.82,80.64 77.47,80.64 v78.11,81.28 IC20.10 81.36,81.28 81.99,80.64 87.79,80.64 88.42,80.01 IC22.9
IMM_0  (via drill 0.35)
  Top 0.152: v27.79,38.89 27.79,40.09 28.02,40.32 v28.02,44.81
  Bottom 0.152: IC4.18 30.84,37.34 29.67,36.18 28.11,36.18 27.82,36.48 IC7.18 27.82,38.86 v27.79,38.89 | IC1.18 v28.02,44.81 22.03,44.81 21.43,45.4 19.53,45.4 IMM_C0.7
IMM_1  (via drill 0.35)
  Top 0.152: v27.15,39.54 27.15,40.17 27.39,40.4 v27.39,44.16
  Bottom 0.152: IC4.17 30.82,36.69 30,35.88 27.46,35.88 27.17,36.17 IC7.17 27.17,39.52 v27.15,39.54 | IC1.17 v27.38,44.16 v27.39,44.16 27.36,44.13 IMM_C0.8
IMM_2  (via drill 0.35)
  Top 0.152: v26.51,38.89 26.51,40.24 26.75,40.48 v26.75,43.51
  Bottom 0.152: IC4.16 30.86,36.04 30.37,35.56 26.99,35.56 26.52,36.03 IC7.16 v26.51,38.89 | IC1.16 v26.75,43.51 22.07,43.51 21.43,42.86 19.53,42.86 IMM_C0.9
IMM_3  (via drill 0.35)
  Top 0.152: v25.8,39.53 25.8,40.24 26.11,40.56 v26.11,42.85
  Bottom 0.152: IC4.15 30.86,35.39 30.7,35.23 26.36,35.23 25.87,35.73 IC7.15 25.87,39.46 v25.8,39.53 | IC1.15 v26.11,42.85 22.06,42.85 IMM_C0.10
IMM_4  (via drill 0.35)
  Top 0.152: v25.18,38.81 25.18,40.24 25.48,40.55 v25.48,42.2 | v25.48,42.2
  Bottom 0.152: IC4.14 30.86,34.74 30.7,34.9 25.58,34.9 25.22,35.27 IC7.14 25.22,38.77 v25.18,38.81 | IC1.14 v25.48,42.2 | v25.48,42.2 | v25.48,42.2 23.31,42.2 21.43,40.32 19.53,40.32 IMM_C0.11
IMM_5  (via drill 0.35)
  Top 0.152: v24.53,39.53 24.53,40.16 24.84,40.48 v24.84,41.55
  Bottom 0.152: IC4.13 30.86,34.09 30.38,34.57 25.12,34.57 24.57,35.12 IC7.13 24.57,39.49 v24.53,39.53 | IC1.13 v24.84,41.55 23.3,41.55 IMM_C0.12
IMM_6
  Bottom 0.152: IC4.12 30.86,33.44 30.06,34.24 24.82,34.24 23.92,35.14 IC7.12 23.92,38.47 23.5,38.89 23.02,38.89 | IMM_C0.13 19.53,37.78 21.43,37.78 22.54,38.89 23.02,38.89 | IC1.12 23.76,40.91 23.02,40.16 23.02,38.89
IMM_7  (via drill 0.35)
  Top 0.152: v23.65,39.85 23.65,39.37 IMM_C0.14
  Bottom 0.152: IC4.11 30.86,32.79 29.84,33.81 29.69,33.81 24.49,33.81 23.27,35.04 IC7.11 21.69,37.41 IMM_C0.14 | IC1.11 24.06,40.26 v23.65,39.85
IMM_8  (via drill 0.35)
  Top 0.152: v30,29.88 30,24.77 v30.56,24.21 | v43.74,23.69 43.74,21.23 41.91,19.41 41.91,8.97 v44.69,6.19
  Bottom 0.152: IC2.18 30.8,29.88 v30,29.88 23.77,29.88 22.7,30.96 22.7,34.61 22.07,35.24 19.53,35.24 IMM_C0.15 | IC5.18 v43.74,23.69 31.08,23.69 v30.56,24.21 | IC10.14 44.71,6.17 v44.69,6.19
IMM_9  (via drill 0.35)
  Top 0.152: v29.61,23.97 29.37,24.21 v29.37,29.23 | v29.37,29.23 | v43.97,5.56 41.59,7.94 41.59,19.55 43.1,21.06 v43.1,23.04
  Bottom 0.152: IC2.17 v29.37,29.23 28.1,29.23 23.99,29.23 22.4,30.83 22.4,32.37 IMM_C0.16 | IC5.17 v43.1,23.04 | v43.1,23.04 30.54,23.04 v29.61,23.97 | IC10.13 44.01,5.52 v43.97,5.56 | v43.1,23.04
IMM_10  (via drill 0.35)
  Top 0.152: v28.73,23.73 v28.73,28.57 v28.73,28.58 | v43.34,4.84 41.27,6.91 41.27,19.69 42.47,20.88 v42.47,22.39
  Bottom 0.152: IC2.16 v28.73,28.58 | v28.73,28.58 | IC5.16 v42.47,22.39 | v28.73,23.73 30.06,22.39 v42.47,22.39 | v28.73,28.58 27.78,28.58 | 27.78,28.58 | IC10.12 43.37,4.87 v43.34,4.84 | v42.47,22.39 | IMM_C0.17 19.53,32.7 21.43,32.7 22.07,32.07 22.07,30.73 24.21,28.58 27.78,28.58
IMM_11  (via drill 0.35)
  Top 0.152: v27.84,23.4 27.84,27.84 v27.94,27.93 | v42.62,4.21 40.97,5.86 40.97,19.85 41.83,20.71 v41.83,21.74
  Bottom 0.152: IC2.15 v27.94,27.93 24.3,27.93 IMM_C0.18 | IC5.15 v41.83,21.74 | v27.84,23.4 29.5,21.74 v41.83,21.74 | IC10.11 42.64,4.22 v42.62,4.21 | v41.83,21.74
IMM_12  (via drill 0.35)
  Top 0.152: v42.22,31.12 42.05,30.95 v42.05,25.34
  Bottom 0.152: 46.06,31.12 IC8.18 46.06,31.12 | v42.05,25.34 42.05,25.3 41.66,24.91 35.26,24.91 32.88,27.28 IC2.14 24.31,27.28 21.39,30.2 19.56,30.2 IMM_C0.19 | 46.06,31.12 v42.22,31.12
IMM_13  (via drill 0.35)
  Top 0.152: v42.86,30.48 42.85,30.47 v42.85,25.89
  Bottom 0.152: v42.86,30.48 42.88,30.5 IC8.17 | v42.85,25.89 42.85,25.15 42.31,24.61 34.93,24.61 32.9,26.63 IC2.13 23.06,26.63 IMM_C0.20
IMM_14  (via drill 0.35)
  Top 0.152: v43.57,25.17 v43.57,29.77
  Bottom 0.152: v43.57,25.17 42.71,24.3 34.55,24.3 32.87,25.98 IC2.12 23.07,25.98 21.43,27.62 19.53,27.62 IMM_C0.21 | 43.65,29.85 v43.57,29.77 43.65,29.85 | 43.65,29.85 IC8.16
IMM_15  (via drill 0.35)
  Top 0.152: v44.29,29.21 v44.29,24.44
  Bottom 0.152: v44.29,24.44 43.49,24.44 43.05,24 34.27,24 32.93,25.33 IC2.11 21.82,25.33 IMM_C0.22 | IC8.15 v44.3,29.2 v44.29,29.21
IMM_16  (via drill 0.35)
  Top 0.152: v39.54,28.57 36.83,28.57 35,26.75 35,16.59 34.77,16.35 v33.34,16.35 | v26.04,24.29 v26.04,16.19
  Bottom 0.152: v33.34,16.35 33.22,16.23 IC3.18 26.07,16.23 v26.04,16.19 | IMM_C0.23 19.53,25.08 21.43,25.08 22.23,24.29 v26.04,24.29 | v39.54,28.57 46.07,28.57 IC8.14
IMM_17  (via drill 0.35)
  Top 0.152: v38.81,27.86 36.59,27.86 35.32,26.59 35.32,16.26 34.69,15.63 v33.9,15.63 | v25.4,15.56 v25.4,23.65
  Bottom 0.152: v33.9,15.63 33.85,15.58 IC3.17 31.79,15.56 v25.4,15.56 | v25.4,23.65 25.24,23.81 IMM_C0.24 | IC8.13 38.86,27.9 v38.81,27.86
IMM_18  (via drill 0.35)
  Top 0.152: v39.61,27.25 36.46,27.25 35.64,26.43 35.64,15.95 v34.61,14.92 | v24.77,14.92 v24.77,22.54
  Bottom 0.152: v34.61,14.92 IC3.16 v24.77,14.93 v24.77,14.92 | v24.77,22.54 19.53,22.54 IMM_C0.25 | v39.61,27.25 IC8.12
IMM_19  (via drill 0.35)
  Top 0.152: v33.89,14.29 35.24,14.29 35.96,15 35.96,25.8 36.83,26.67 38.73,26.67 v38.81,26.59 | v24.13,14.29 v24.13,21.91
  Bottom 0.152: v33.89,14.29 v33.89,14.28 IC3.15 v24.14,14.28 v24.13,14.29 | v24.13,21.91 21.43,21.91 IMM_C0.26 | IC8.11 38.83,26.6 v38.81,26.59
IMM_20  (via drill 0.35)
  Top 0.152: v44.61,16.19 v44.61,21.09 | v29.05,13.65 v29.05,21.09 | v29.05,21.09
  Bottom 0.152: IC5.14 v44.61,21.09 v29.05,21.09 22.52,21.09 21.43,20 19.53,20 IMM_C0.27 | IC9.18 44.65,16.23 v44.61,16.19 | IC3.14 29.07,13.63 v29.05,13.65
IMM_21  (via drill 0.35)
  Top 0.152: v43.81,20.44 43.97,20.29 v43.97,15.55 | v28.42,13.02 v28.42,20.44
  Bottom 0.152: IC5.13 v43.81,20.44 v28.42,20.44 22.5,20.44 IMM_C0.28 | IC9.17 44,15.58 v43.97,15.55 | IC3.13 31.77,13.02 v28.42,13.02
IMM_22  (via drill 0.35)
  Top 0.152: v43.18,19.79 43.32,19.65 v43.32,14.91 | v27.78,12.38 v27.78,19.79
  Bottom 0.152: IC5.12 v43.18,19.79 | v43.18,19.79 v27.78,19.79 23.76,19.79 21.43,17.46 19.53,17.46 IMM_C0.29 | IC9.16 43.35,14.93 v43.32,14.91 | v43.18,19.79 | IC3.12 27.83,12.33 v27.78,12.38
IMM_23  (via drill 0.35)
  Top 0.152: v42.55,19.14 42.68,19 v42.68,14.27 | v27.15,11.75 v27.15,19.14
  Bottom 0.152: IC5.11 v42.55,19.14 | v42.55,19.14 | IMM_C0.30 23.75,19.14 v27.15,19.14 v42.55,19.14 | IC3.11 27.21,11.68 v27.15,11.75 | v42.68,14.27 42.7,14.28 IC9.15
IMM_24  (via drill 0.35)
  Top 0.152: v30.16,8.77 33.97,8.77 38.86,13.65 v39.21,13.65
  Bottom 0.152: IC6.18 v30.16,8.77 27.59,8.77 21.43,14.92 19.53,14.92 IMM_C0.31 | v39.21,13.65 46.07,13.65 IC9.14
IMM_25  (via drill 0.35)
  Top 0.152: v29.53,8.12 33.76,8.12 38.65,13.01 v40.01,13.01
  Bottom 0.152: IC6.17 28.89,8.12 | 28.89,8.12 v29.53,8.12 | v29.53,8.12 | IMM_C0.32 26.33,8.12 28.89,8.12 | IC9.13 40.04,12.98 v40.01,13.01
IMM_26  (via drill 0.35)
  Top 0.152: v30.16,7.47 33.58,7.47 38.41,12.3 v39.2,12.3
  Bottom 0.152: IC6.16 v30.16,7.47 | v30.16,7.47 | IMM_C0.33 19.56,12.42 21.39,12.42 26.34,7.47 v30.16,7.47 | v39.2,12.3 46.06,12.3 IC9.12
IMM_27  (via drill 0.35)
  Top 0.152: v29.53,6.82 33.41,6.82 38.26,11.67 v40.01,11.67
  Bottom 0.152: IC6.15 v29.53,6.82 | v29.53,6.82 | IMM_C0.34 25.09,6.82 v29.53,6.82 | v40.01,11.67 v40.02,11.68 IC9.11
IMM_28
  Bottom 0.152: IMM_C0.35 19.53,9.84 21.43,9.84 25.11,6.17 IC6.14 33.52,6.17 35.89,3.8 39.29,3.8 44.26,8.77 IC10.18
IMM_29
  Bottom 0.152: IMM_C0.36 23.85,5.52 IC6.13 33.38,5.52 35.4,3.49 39.41,3.49 44.04,8.12 IC10.17
IMM_30
  Bottom 0.152: IMM_C0.37 19.53,7.3 21.43,7.3 23.86,4.87 IC6.12 33.23,4.87 34.92,3.17 39.53,3.17 43.82,7.47 IC10.16
IMM_31
  Bottom 0.152: IMM_C0.38 22.61,4.22 IC6.11 33.09,4.22 33.97,3.33 34.45,2.86 39.69,2.86 43.65,6.82 IC10.15
IMM_GEN_CTR_0  (via drill 0.35)
  Top 0.152: v77.87,86.36 77.79,86.44 v77.79,89.85
  Bottom 0.152: v77.87,86.36 IC19.1 | v77.79,89.85 73.34,89.85 68.9,94.3 57.74,94.3 57.29,94.75 56.83,94.75 55.88,95.7 PROG_THR_C0.2
IMM_GEN_CTR_1  (via drill 0.35)
  Top 0.152: v77.87,85.09 78.74,85.96 v78.74,89.85
  Bottom 0.152: IC19.2 v77.87,85.09 | v78.74,89.85 78.18,90.41 73.22,90.41 69.02,94.6 59.54,94.6 PROG_THR_C0.4
IMM_GEN_CTR_2  (via drill 0.35)
  Top 0.152: v79.69,89.85 79.69,85.72 v77.79,83.82
  Bottom 0.152: IC19.3 v77.79,83.82 | PROG_THR_C0.6 62.23,97 67.06,97 73.34,90.71 78.83,90.71 v79.69,89.85
INS_0  (via drill 0.35)
  Top 0.152: U1.13 29.13,55.4 30.16,55.4 31.11,55.4 31.75,54.77 31.75,52.14 v32.1,51.79 | IC32.15 76,40.36 75.56,40.8 v75.56,44.13
  Bottom 0.152: v32.1,51.79 32.79,51.1 37.94,51.1 41.4,51.1 46.79,45.72 67.79,45.72 69.37,44.13 v75.56,44.13 INS_C0.1
INS_1  (via drill 0.35)
  Top 0.152: IC32.1 70.59,41.01 v68.74,42.86
  Bottom 0.152: U1.14 30.48,52.47 32.15,50.8 41.27,50.8 48.58,43.49 66.03,43.49 66.66,42.86 v68.74,42.86 94.3,42.86 INS_C0.2
INS_2  (via drill 0.35)
  Top 0.152: IC32.2 69.97,40.36 v68.74,41.59
  Bottom 0.152: U1.15 29.21,55.32 29.21,53.18 31.9,50.49 41.15,50.49 48.45,43.19 65.71,43.19 67.31,41.59 v68.74,41.59 INS_C0.3
INS_3  (via drill 0.35)
  Top 0.152: IC32.3 69.35,39.71 v68.74,40.32
  Bottom 0.152: U1.17 31.83,57.78 30.16,57.78 28.91,56.53 28.91,53.05 31.77,50.19 41.02,50.19 50.27,40.94 63.67,40.94 64.29,40.32 v68.74,40.32 94.3,40.32 INS_C0.4
INS_4  (via drill 0.35)
  Top 0.152: v35.56,49.63 U1.18 | v68.74,39.05 v68.75,39.06 IC32.4
  Bottom 0.152: v35.56,49.63 35.72,49.79 40.99,49.79 50.15,40.64 63.34,40.64 64.93,39.05 v68.74,39.05 INS_C0.5
INS_5  (via drill 0.35)
  Top 0.152: v34.75,49.63 34.75,53.6 34.67,53.69 34.67,55.7 U1.19 | IC32.5 69.37,38.41 v68.74,37.78
  Bottom 0.152: v34.75,49.63 34.77,49.63 35.3,49.11 | 35.33,49.08 35.3,49.11 | 35.3,49.11 35.33,49.08 | 35.33,49.08 36.06,49.08 36.47,49.49 40.86,49.49 52.57,37.78 v68.74,37.78 94.3,37.78 INS_C0.6
INS_6  (via drill 0.35)
  Top 0.152: v38.1,48.93 U1.20 | v68.74,36.51 69.99,37.76 IC32.6
  Bottom 0.152: v38.1,48.93 40.99,48.93 53.41,36.51 v68.74,36.51 INS_C0.7
INS_25  (via drill 0.35)
  Top 0.152: v34.53,34.77 34.53,42.15 v34.52,42.16 | v45.4,34.79 47.44,32.75 47.44,32.07 47.44,14.2 v47.57,14.07 | IC35.1 70.59,10.53 v68.74,12.38 | U4.14 62.86,31.12 62.86,12.63 v62.61,12.38
  Bottom 0.152: v34.53,34.77 34.55,34.74 IC4.7 37.45,34.79 v45.4,34.79 | v34.52,42.16 37.36,42.16 IC1.7 | v47.57,14.07 49.43,14.07 49.87,13.63 IC9.7 55.59,13.63 56.83,12.38 v62.61,12.38 v68.74,12.38 94.3,12.38 INS_C0.26
INS_26  (via drill 0.35)
  Top 0.152: v35.16,34.06 v35.16,41.51 | v47.07,35.32 48.05,34.34 48.05,15.75 48.84,14.95 v48.84,13.34 | IC35.2 69.97,9.88 v68.74,11.11 | U4.15 55.72,40.8 55.72,39.21 63.17,31.77 63.17,11.36 v62.91,11.11
  Bottom 0.152: v35.16,34.06 35.19,34.09 IC4.8 45.84,34.09 v47.07,35.32 | v35.16,41.51 35.2,41.55 IC1.8 | v48.84,13.34 49.53,13.34 49.88,12.98 IC9.8 55.12,12.98 56.99,11.11 v62.91,11.11 v68.74,11.11 INS_C0.27
INS_27  (via drill 0.35)
  Top 0.152: v35.96,33.42 35.96,40.8 v35.88,40.88 | v48.66,33.42 48.35,33.11 48.35,15.88 49.45,14.78 49.45,12.99 v48.84,12.38 | IC35.3 69.35,9.23 v68.74,9.84 | U4.17 58.26,40.8 58.26,39.21 63.47,34 63.47,10.09 v63.22,9.84
  Bottom 0.152: v35.96,33.42 35.98,33.44 IC4.9 48.63,33.44 v48.66,33.42 | v35.88,40.88 35.9,40.91 IC1.9 | v48.84,12.38 48.9,12.33 IC9.9 54.82,12.33 57.31,9.84 v63.22,9.84 v68.74,9.84 94.3,9.84 INS_C0.28
INS_28  (via drill 0.35)
  Top 0.152: v49.29,23.89 48.66,23.26 48.66,16.03 50.05,14.64 50.05,12.58 49.32,11.86 49.32,9.63 v49.64,9.32 49.64,7.38 44.59,2.33 32.21,2.33 27.53,7.01 27.53,10.89 29.61,12.97 29.61,19.21 32.42,22.02 32.42,29.05 v33.47,30.11 | IC35.4 v68.75,8.58 v68.74,8.57 | U4.18 63.78,35.28 63.78,8.82 v63.52,8.57
  Bottom 0.152: IC5.2 50.4,24.34 49.74,24.34 v49.29,23.89 | v33.47,30.11 35.93,30.11 36.36,30.53 IC2.2 | v49.64,9.32 49.74,9.42 IC10.2 55.83,9.42 56.67,8.57 v63.52,8.57 v68.74,8.57 INS_C0.29
INS_29  (via drill 0.35)
  Top 0.152: v33.56,29.15 32.75,28.34 32.75,21.89 29.96,19.1 29.96,12.83 27.86,10.73 27.86,7.11 32.34,2.63 44.46,2.63 48.91,7.08 v48.91,8.75 | IC35.5 69.37,7.93 v68.74,7.3 | U4.19 60.96,40.64 60.96,38.73 64.08,35.61 64.08,7.55 v63.83,7.3 | v54.77,23.65 v54.77,8.77
  Bottom 0.152: v33.56,29.15 35.86,29.15 36.6,29.88 IC2.3 | v48.91,8.75 51.73,8.75 51.75,8.77 IC10.3 v54.77,8.77 55.68,8.77 57.15,7.3 v63.83,7.3 v68.74,7.3 94.3,7.3 INS_C0.30 | IC5.3 54.77,23.69 v54.77,23.65
INS_31  (via drill 0.35)
  Top 0.152: v40.01,25.56 v40.01,14.29 40.66,13.63 40.66,8.6 v40.16,8.1 40.16,5.32 v41.99,3.49 | v66.2,47.07 66.2,43.5 U4.21 64.69,4.84 v64.77,4.76 | IC35.7 70.61,6.63 v68.74,4.76 | v53.5,19.68 v53.5,7.47
  Bottom 0.152: IC3.9 IC3.8 IC3.7 IC3.6 | IC3.6 IC3.5 IC3.4 IC3.3 IC3.2 | IC5.6 IC5.7 IC5.8 IC5.9 53.39,19.79 | IC2.6 IC2.7 IC2.8 IC2.9 38.44,25.98 38.86,25.56 v40.01,25.56 | IC6.2 IC6.3 IC6.4 37.41,8.1 | 37.41,8.1 IC6.5 IC6.6 IC6.7 IC6.8 IC6.9 | v40.01,14.29 40,14.28 IC3.6 | v40.16,8.1 37.41,8.1 | IC21.1 96.52,54.41 93.39,51.29 85.69,51.29 82.12,47.72 66.85,47.72 v66.2,47.07 | v41.99,3.49 47.62,3.49 48.9,4.76 48.9,6.03 48.97,6.11 50.33,7.47 IC10.5 v53.5,7.47 54.76,7.47 57.47,4.76 v64.77,4.76 v68.74,4.76 79.81,4.76 81.72,6.68 89.68,6.68 91.6,4.76 94.3,4.76 INS_C0.32 | 53.39,19.79 v53.5,19.68 53.39,19.79
INS_F3_0  (via drill 0.35)
  Top 0.152: v71.51,69.64 70.92,69.05 70.92,55.42 83.01,43.34 83.01,29.14 v82.76,28.89 | IC33.4 v68.75,28.9 v68.74,28.89
  Bottom 0.152: v71.51,69.64 60.59,69.64 U2.18 | IC8.2 54.13,31.8 57.04,28.89 v68.74,28.89 77.15,28.89 v82.76,28.89 INS_C0.13
INS_F3_1  (via drill 0.35)
  Top 0.152: v72.42,70.25 72.42,69.69 71.22,68.5 71.22,55.55 83.31,43.46 83.31,27.87 v83.06,27.62 | IC33.5 69.37,28.25 v68.74,27.62
  Bottom 0.152: v72.42,70.25 60.56,70.25 U2.19 | IC8.3 53.87,31.15 57.4,27.62 v68.74,27.62 v83.06,27.62 94.3,27.62 INS_C0.14
INS_F3_2  (via drill 0.35)
  Top 0.152: v72.42,68.58 71.53,67.69 71.53,55.67 83.62,43.59 83.62,26.6 v83.37,26.35 | IC33.6 69.99,27.6 v68.74,26.35
  Bottom 0.152: v72.42,68.58 62.23,68.58 U2.20 | IC8.4 53.77,30.5 57.92,26.35 v68.74,26.35 v83.37,26.35 INS_C0.15
INS_I  (via drill 0.35)
  Top 0.152: v33.57,28.19 33.08,27.7 33.08,24.75 33.08,21.73 30.31,18.96 30.31,12.69 28.21,10.59 28.21,7.19 32.47,2.94 44.21,2.94 48.26,6.99 v48.26,8.1 | IC35.6 69.99,7.28 v68.74,6.03 | U4.20 64.39,37.21 64.39,6.28 v64.14,6.03 | v54.13,23.02 v54.13,8.12
  Bottom 0.152: v33.57,28.19 35.39,28.19 36.44,29.23 IC2.4 | v48.26,8.1 48.28,8.12 IC10.4 v54.13,8.12 55.38,8.12 57.47,6.03 v64.14,6.03 v68.74,6.03 73.34,6.03 73.66,5.71 80.33,5.71 81.6,6.99 92.08,6.99 INS_C0.31 | IC5.4 54.11,23.04 v54.13,23.02
INS_R1_0  (via drill 0.35)
  Top 0.152: v73.03,71.12 73.03,67.55 71.83,66.36 71.83,55.8 83.92,43.71 83.92,25.33 v83.67,25.08 | IC33.7 70.61,26.95 v68.74,25.08
  Bottom 0.152: v73.03,71.12 64.77,71.12 U2.21 | IC8.5 53.51,29.85 58.28,25.08 v68.74,25.08 v83.67,25.08 94.3,25.08 INS_C0.16
INS_R1_1  (via drill 0.35)
  Top 0.152: U3.13 75.88,53.74 84.23,45.39 84.23,24.06 v83.97,23.81 | IC34.15 76.16,20.04 76.04,20.16 v76.04,23.81
  Bottom 0.152: IC8.6 53.41,29.2 58.8,23.81 v76.04,23.81 v83.97,23.81 INS_C0.17
INS_R1_2  (via drill 0.35)
  Top 0.152: U3.14 79.03,53.44 79.03,51.06 84.53,45.56 84.53,22.79 v84.28,22.54 | IC34.1 70.59,20.69 v68.74,22.54
  Bottom 0.152: IC8.7 53.32,28.55 59.33,22.54 v68.74,22.54 v84.28,22.54 94.3,22.54 INS_C0.18
INS_R1_3  (via drill 0.35)
  Top 0.152: U3.15 79.64,55.38 79.64,51.01 84.84,45.81 84.84,21.52 v84.58,21.27 | IC34.2 69.97,20.04 v68.74,21.27
  Bottom 0.152: IC8.8 53.38,27.9 60.01,21.27 v68.74,21.27 v84.58,21.27 INS_C0.19
INS_R1_4  (via drill 0.35)
  Top 0.152: U3.17 82.25,55.31 82.25,53.32 85.14,50.43 85.14,20.85 84.89,20.6 v84.89,20 | IC34.3 69.35,19.39 v68.74,20
  Bottom 0.152: IC8.9 53.28,27.25 60.53,20 v68.74,20 v84.89,20 94.3,20 INS_C0.20
INS_R2_0  (via drill 0.35)
  Top 0.152: v49.85,22.38 49.85,17.07 v50.09,16.83 | v82.39,71.99 82.39,55.96 83.5,54.85 U3.18 85.45,52.11 85.45,18.98 v85.19,18.73 | v97.71,82.55 97.71,77.39 v95.73,75.41 | IC34.4 v68.75,18.74 v68.74,18.73
  Bottom 0.152: IC5.5 v49.85,22.39 v49.85,22.38 | v50.09,16.83 51.64,16.83 IC9.2 57.84,16.88 59.69,18.73 v68.74,18.73 v85.19,18.73 INS_C0.21 | v82.39,71.99 82.95,72.55 92.39,72.55 94.77,74.93 95.25,74.93 v95.73,75.41 | v97.71,82.55 IC22.4
INS_R2_1  (via drill 0.35)
  Top 0.152: U3.19 84.81,55.28 84.81,53.46 85.75,52.52 85.75,17.71 v85.5,17.46 | v50.56,35.12 50.64,35.12 57.31,28.45 v57.31,16.23 | IC34.5 69.37,18.09 v68.74,17.46
  Bottom 0.152: IC4.3 47.07,37.34 49.29,35.12 v50.56,35.12 | IC9.3 v57.31,16.23 | v57.31,16.23 | v57.31,16.23 57.78,16.23 59.01,17.46 v68.74,17.46 v85.5,17.46 94.3,17.46 INS_C0.22
INS_R2_2  (via drill 0.35)
  Top 0.152: v50.48,34.21 50.67,34.21 56.59,28.29 56.59,16.85 v56.59,15.58 | v85.8,16.19 85.8,16.75 86.06,17 86.06,54.04 U3.20 | IC34.6 69.99,17.44 v68.74,16.19
  Bottom 0.152: IC4.4 47.21,36.69 49.69,34.21 v50.48,34.21 | IC9.4 v56.59,15.58 58.08,15.58 58.69,16.19 v68.74,16.19 v85.8,16.19 INS_C0.23
INS_R2_3  (via drill 0.35)
  Top 0.152: v50.48,33.26 50.56,33.26 55.88,27.94 55.88,15.88 v55.88,14.93 | U3.21 88.58,53.9 86.36,51.67 v86.36,14.93 | IC34.7 70.6,16.79 v68.74,14.93
  Bottom 0.152: IC4.5 47.3,36.04 50.09,33.26 v50.48,33.26 | IC9.5 v55.88,14.93 v68.74,14.93 v86.36,14.93 v86.37,14.92 94.3,14.92 INS_C0.24
INS_R2_4  (via drill 0.35)
  Top 0.152: v48.24,14.68 48.24,15.08 47.74,15.58 47.74,33.73 v46.12,35.36 | IC35.15 76.16,9.88 76.04,10 v76.04,13.65 | U4.13 51.99,40.24 62.56,29.68 62.56,13.9 v62.31,13.65
  Bottom 0.152: IC4.6 46.08,35.39 v46.12,35.36 | v48.24,14.68 49.29,14.68 49.7,14.28 51.75,14.28 IC9.6 55.73,14.28 56.36,13.65 v62.31,13.65 v76.04,13.65 INS_C0.25
INS_WR_0  (via drill 0.35)
  Top 0.152: v86.04,71.52 86.04,80.7 v84.19,82.55 | v90.09,71.52 90.09,66.12 91.06,65.15 91.06,54.07 90.73,53.74 v90.73,50.73 | v40.64,48.38 U1.21 | v68.74,35.24 70.61,37.11 IC32.7 | v76.52,47.16 76.99,47.16 81.48,42.67 81.48,35.49 v81.23,35.24
  Bottom 0.152: IC25.1 96.52,70.57 95.57,71.52 v90.09,71.52 90.08,71.5 86.06,71.5 v86.04,71.52 | v84.19,82.55 IC20.4 | v40.64,48.38 41.11,48.38 54.25,35.24 v68.74,35.24 v81.23,35.24 94.3,35.24 INS_C0.8 | v90.73,50.73 85.57,50.73 82.25,47.41 76.77,47.41 v76.52,47.16
INS_WR_1  (via drill 0.35)
  Top 0.152: v73.03,73.98 69.06,70.01 69.06,67.15 69.7,66.51 69.7,54.88 81.79,42.8 81.79,34.22 v81.54,33.97 | IC33.15 76.16,30.2 76.04,30.32 v76.04,33.97
  Bottom 0.152: IC1.3 44.15,44.8 54.99,33.97 v76.04,33.97 v81.54,33.97 INS_C0.9 | v73.03,73.98 72.47,73.98 71.81,73.32 71.75,73.26 71.28,72.79 61.36,72.79 60.83,73.32 57.12,73.32 56.04,72.23 53.02,72.23 U2.13
INS_WR_2  (via drill 0.35)
  Top 0.152: v69.7,67.79 70.01,67.48 70.01,55.01 82.09,42.92 82.09,32.95 v81.84,32.7 | IC33.1 70.59,30.85 v68.74,32.7
  Bottom 0.152: IC1.4 44.23,44.16 55.69,32.7 v68.74,32.7 v81.84,32.7 94.3,32.7 INS_C0.10 | v69.7,67.79 62.53,67.79 62.52,67.77 55.42,67.77 U2.14
INS_WR_3  (via drill 0.35)
  Top 0.152: v73.03,73.06 70.31,70.35 70.31,55.14 82.4,43.05 82.4,31.68 v82.15,31.43 | IC33.2 69.97,30.2 v68.74,31.43
  Bottom 0.152: IC1.5 44.31,43.51 56.39,31.43 v68.74,31.43 v82.15,31.43 INS_C0.11 | v73.03,73.06 72.27,73.06 72.22,73.01 72.23,73.03 71.68,72.47 61.2,72.47 60.66,73.01 57.3,73.01 56.12,71.83 55.17,71.83 U2.15
INS_WR_4  (via drill 0.35)
  Top 0.152: v73.03,72.15 70.61,69.74 70.61,55.3 82.7,43.21 82.7,30.41 v82.45,30.16 | IC33.3 69.35,29.55 v68.74,30.16
  Bottom 0.152: IC1.6 44.47,42.85 57.16,30.16 v68.74,30.16 v82.45,30.16 94.3,30.16 INS_C0.12 | U2.17 57.07,72.31 57.47,72.71 60.48,72.71 61.04,72.15 v73.03,72.15
N$2
  Bottom 0.152: IC21.4 94.62,61.44 96.52,63.34 IC26.1
N$3  (via drill 0.35)
  Top 0.152: v95.57,73.58 v95.57,65.17
  Bottom 0.152: v95.57,73.58 95.06,73.58 94.62,73.13 IC25.4 | v95.57,65.17 IC26.2
N$5
  Top 0.152: IC32.9 77.09,36.14 75.25,34.29 75.25,30.32 76.02,29.55 IC33.14
N$6
  Top 0.152: IC33.9 77.09,25.82 75.41,24.13 75.41,20 76.02,19.39 IC34.14
N$7
  Top 0.152: IC34.9 77.09,15.82 75.41,14.13 75.41,10 76.18,9.23 IC35.14
N$9  (via drill 0.35)
  Top 0.152: v29.53,94.93 v20.16,94.93
  Bottom 0.152: IC38.14 29.55,94.95 v29.53,94.93 | v20.16,94.93 20.11,94.98 IC37.9
N$10  (via drill 0.35)
  Top 0.152: v35.88,92.55 35.72,92.39 v26.35,92.39
  Bottom 0.152: IC39.14 35.74,92.69 v35.88,92.55 | v26.35,92.39 26.3,92.44 IC38.9
PC_ADR_2
  Top 0.152: PC_ADR_C0.3 5.73,92.71 7.62,92.71 8.26,92.08 8.26,90.81 9.23,89.83 IC11.2
PC_ADR_3
  Top 0.152: PC_ADR_C0.4 9.24,89.18 IC11.3
PC_ADR_4
  Top 0.152: PC_ADR_C0.5 5.73,90.17 7.62,90.17 9.26,88.53 IC11.4
PC_ADR_5
  Top 0.152: PC_ADR_C0.6 8,87.88 IC11.5
PC_ADR_6
  Top 0.152: PC_ADR_C0.7 5.73,87.63 7.62,87.63 8.02,87.23 IC11.6
PC_ADR_7
  Top 0.152: PC_ADR_C0.8 7.21,86.58 IC11.7
PC_ADR_8
  Top 0.152: PC_ADR_C0.9 5.73,85.09 7.62,85.09 8.46,85.93 IC11.8
PC_ADR_9
  Top 0.152: PC_ADR_C0.10 8.45,85.28 IC11.9
PC_ADR_10
  Top 0.152: PC_ADR_C0.11 5.73,82.55 7.62,82.55 8.26,81.92 8.26,80.64 9.15,79.75 IC12.2
PC_ADR_11
  Top 0.152: PC_ADR_C0.12 9.16,79.09 IC12.3
PC_ADR_12
  Top 0.152: PC_ADR_C0.13 5.73,80.01 7.62,80.01 9.19,78.44 IC12.4
PC_ADR_13
  Top 0.152: PC_ADR_C0.14 7.92,77.8 IC12.5
PC_ADR_14
  Top 0.152: PC_ADR_C0.15 5.73,77.47 7.62,77.47 7.95,77.14 IC12.6
PC_ADR_15
  Top 0.152: PC_ADR_C0.16 7.29,76.5 IC12.7
PC_ADR_16
  Top 0.152: PC_ADR_C0.17 5.73,74.93 7.62,74.93 8.54,75.84 IC12.8
PC_ADR_17
  Top 0.152: PC_ADR_C0.18 8.53,75.19 IC12.9
PC_ADR_18
  Top 0.152: PC_ADR_C0.19 5.73,72.39 7.62,72.39 9.08,70.93 IC13.2
PC_ADR_19
  Top 0.152: PC_ADR_C0.20 8.26,71.11 9.08,70.28 IC13.3
PC_ADR_20
  Top 0.152: PC_ADR_C0.21 5.73,69.85 9.05,69.85 9.26,69.63 IC13.4
PC_ADR_21
  Top 0.152: PC_ADR_C0.22 8.89,68.57 9.31,68.98 IC13.5
PC_ADR_22
  Top 0.152: PC_ADR_C0.23 5.73,67.31 8.32,67.31 9.34,68.33 IC13.6
PC_ADR_23
  Top 0.152: PC_ADR_C0.24 7.94,66.03 9.59,67.68 IC13.7
PC_ADR_24
  Top 0.152: PC_ADR_C0.25 5.73,64.77 7.62,64.77 8.26,65.41 8.26,65.88 9.41,67.03 IC13.8
PC_ADR_25
  Top 0.152: IC13.9 9.39,66.38 9.05,66.04 9.05,65.55 PC_ADR_C0.26
PC_DATA_EN  (via drill 0.35)
  Top 0.152: IC11.19 14.58,89.83 14.29,89.53 14.29,79.85 | 14.29,79.85 14.29,71.44 v14.68,71.04 14.79,70.93 IC13.19 | IC12.19 14.39,79.75 14.29,79.85 | v87.31,70.25 87.07,70.01 87.07,61.04 86.04,60.01 U3.24 85.01,58.1 85.01,55.96 85.72,55.24 86.76,55.24 87.63,54.37 v87.63,53.98 | v75.8,70.25 74.22,71.83 74.22,75.88 72.63,75.88 71.83,75.09 v71.83,74.4 | v89.58,53.96 89.58,50.22 v89.53,50.18 | U4.24 62.07,44.53 v60.33,46.28 | v17.62,68.26 18.89,68.26 30.33,79.7 35.23,79.7 35.72,79.22 37.15,79.22 37.86,78.5 IC18.4 37.78,76.31 37.78,75.41 39.21,73.98 v39.21,72.55 36.83,70.17 36.83,65.72 34.92,63.82 34.92,58.42 35.4,57.94 36.91,57.94 U1.24
  Bottom 0.152: v87.31,70.25 v75.8,70.25 | v71.83,74.4 70.96,74.4 70.66,74.7 63.12,74.7 U2.24 62.03,73.62 57,73.62 55.91,72.54 54.29,72.54 54.28,72.55 v39.21,72.55 | v87.63,53.98 89.57,53.98 v89.58,53.96 | v89.53,50.18 85.44,50.18 81.87,46.6 67.72,46.6 67.14,46.02 60.58,46.02 v60.33,46.28 | v17.62,68.26 14.84,71.04 v14.68,71.04
PIN_7  (via drill 0.35)
  Top 0.152: v93.27,53.18 93.27,55.17 92.47,55.96 92.47,76.85 89.34,79.98 v87.59,79.98 | v41.43,51.66 v41.43,45.56
  Bottom 0.152: v87.59,79.98 86.05,79.98 IC20.6 | v93.27,53.18 93.27,53.14 92.03,51.9 85.44,51.9 81.87,48.33 50.58,48.33 50.16,48.74 44.2,48.74 41.43,51.5 v41.43,51.66 | v41.43,45.56 41.33,45.45 IC1.2
PIN_20  (via drill 0.35)
  Top 0.152: v92.23,88.61 92.71,88.13 v92.71,80.01 | v31.11,39.53 31.11,45.88 25.76,51.24 25.76,67.79 v27,69.04
  Bottom 0.152: v27,69.04 29.04,71.08 36.46,71.08 42.24,76.86 45.36,76.86 53.38,84.88 62.56,84.88 66.37,88.69 83.56,88.69 83.68,88.56 85.86,88.56 86.29,88.99 91.85,88.99 v92.23,88.61 | v92.71,80.01 IC22.6 | v31.11,39.53 38.42,39.53 38.89,39.05 38.89,38.42 38.47,37.99 IC4.2
PIN_31  (via drill 0.35)
  Top 0.152: v39.53,29.53 38.83,29.53 33.14,35.21 33.14,51.7 v33.09,51.75 | v91.36,53.18 91.36,55.78 91.37,55.79 91.37,56.29 91.36,56.3 v91.36,66.6
  Bottom 0.152: IC2.5 38.58,28.58 v39.53,29.53 | v91.36,53.18 91.36,53.02 90.85,52.51 84.87,52.51 82.92,50.56 61.66,50.56 60.26,49.16 56.5,49.16 55.1,50.56 43.74,50.56 42.07,52.23 41.02,52.23 40.55,51.75 v33.09,51.75 | v91.36,66.6 91.39,66.63 IC26.4
PRG_A_S  (via drill 0.35)
  Top 0.152: v23.34,92.47 23.97,91.84 38.26,91.84 39.45,93.03 PROG.1
  Bottom 0.152: IC37.14 23.36,92.49 v23.34,92.47
PRG_CLK  (via drill 0.35)
  Top 0.152: IC35.11 78.92,7.28 v79.53,6.67 | v74.77,6.67 v74.77,16.83 v74.77,26.99 v74.77,37.15 74.77,39.89 74.47,40.2 74.47,41.74 74.45,41.75 74.45,49.27 68.45,55.28 68.45,86.85 69.06,87.46 v69.06,90.32 | v79.53,16.83 78.92,17.44 IC34.11 | v79.53,26.99 78.92,27.6 IC33.11 | v79.53,37.15 78.92,37.76 IC32.11 | v21.43,94.14 v27.62,94.14 v33.66,94.14 33.97,94.46 41.12,94.46 PROG.3 43.12,92.46 43.12,90.52 v43.02,90.42 41.81,90.42 R4.2
  Bottom 0.152: v79.53,6.67 v74.77,6.67 | v74.77,16.83 v79.53,16.83 | v74.77,26.99 v79.53,26.99 | v74.77,37.15 v79.53,37.15 | IC37.11 21.41,94.16 v21.43,94.14 | IC39.11 33.79,94.75 33.66,94.61 v33.66,94.14 | IC38.11 27.6,94.16 v27.62,94.14 | v69.06,90.32 68.74,90 63.5,90 63.04,90.46 59.87,90.46 59.58,90.17 43.27,90.17 v43.02,90.42
PRG_D_S  (via drill 0.35)
  Top 0.152: IC32.14 75.38,39.71 74.77,40.32 74.77,49.38 68.75,55.4 68.75,86.69 69.85,87.79 v69.85,89.85 | v37.15,95.09 v32.54,95.09
  Bottom 0.152: v69.85,89.85 69.69,89.69 63.34,89.69 62.88,90.16 59.99,90.16 59.71,89.87 40.31,89.87 37.15,93.03 v37.15,95.09 | v32.54,95.09 32.49,95.14 IC39.9
PRG_DATA_EN  (via drill 0.35)